# EAGLE design ICSP-Breadboard-Adapter-ATMEGA328 (EAGLE 7.5.0)
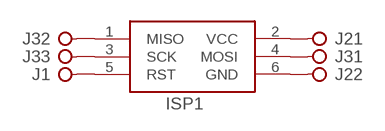
[diagram p0: schematic, sheet 1]

## Parts
ISP1  ICSP-HEADER-6  [ICSP-HEADER]
J1  PINHD-1X1  [1X01]
J2  PINHD-1X2  [1X02]
J3  PINHD-1X3  [1X03]

## Nets
GND: ISP1.6(GND) J2.2
N$1: ISP1.5(RST) J1.1(KL)
N$2: ISP1.2(VCC) J2.1
N$4: ISP1.4(MOSI) J3.1
N$5: ISP1.1(MISO) J3.2
N$6: ISP1.3(SCK) J3.3

## Library data of the parts
ISP1 = SaintGimp:ICSP-HEADER: ICSP HEADER Standard 6 pin header for ICSP programming
J1 = SaintGimp:PINHD-1X1
J2 = SaintGimp:PINHD-1X2
J3 = SaintGimp:PINHD-1X3: PIN HEADER

## Board
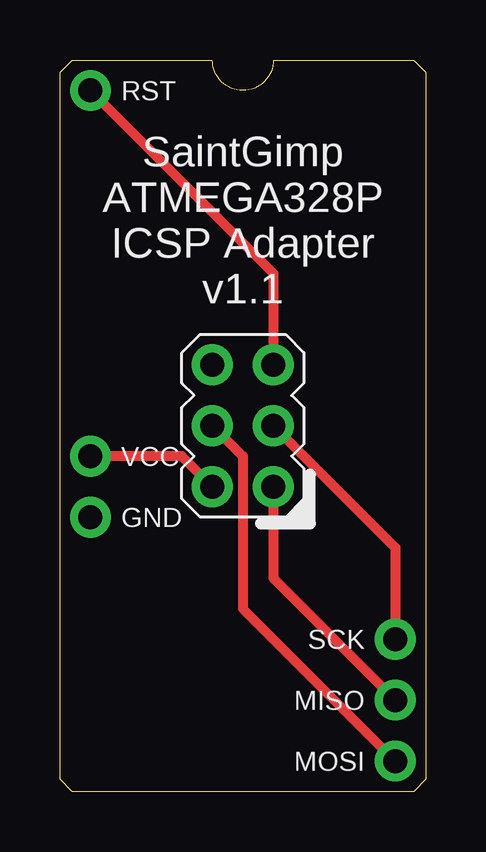
[diagram p1: board, top side]
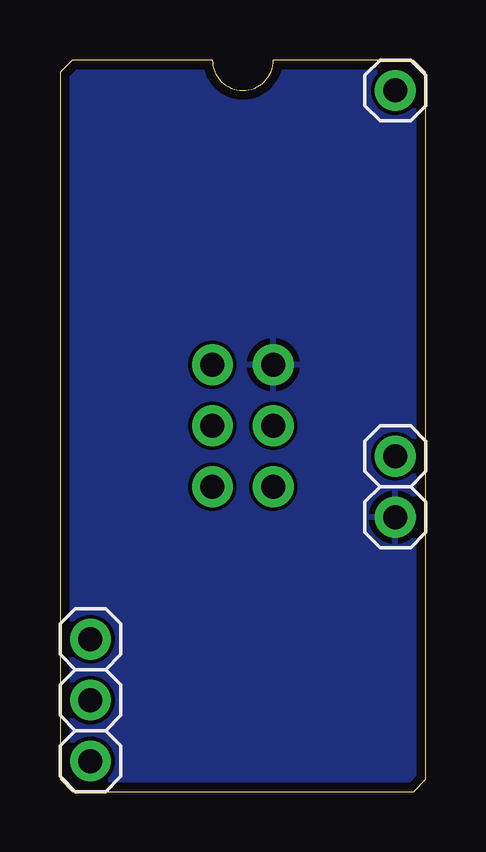
[diagram p2: board, bottom side, seen from below]

Size 15.24 x 30.48 mm. Coordinates in mm from the lower left corner, seen from the top.
Outline: 8.89,30.48 14.73,30.48 15.24,29.97 15.24,0.51 14.73,0 0.51,0 0,0.51 0,29.97 0.51,30.48 6.35,30.48 arc180 8.89,30.48
Copper layers (1*16): Top 0.0356mm / dielectric 1.5011mm / Bottom 0.0356mm
Design rules "Saintgimp-OSHPark *": minimum track width 10mil, minimum drill 13mil, track to track 6mil, track to pad 6mil, pad to pad 6mil, via to via 6mil, smd to smd 6mil, copper to edge 15mil, drill to drill 6mil, minimum pad ring 10mil, minimum via ring 7mil, stop-mask expansion 2mil, vias tented up to drill 24mil, thermal gap 10mil

### Footprints (pad centres in the part's own frame; a part is rotated, then mirrored left to right if it is on the bottom)
ICSP-HEADER = drill 1: 1 -1.27,2.54; 2 1.27,2.54; 3 -1.27,0; 4 1.27,0; 5 -1.27,-2.54; 6 1.27,-2.54
1X01 = drill 1: 1 0,0
1X02 = drill 1: 1 -1.27,0; 2 1.27,0
1X03 = drill 1: 1 -2.54,0; 2 0,0; 3 2.54,0

### Placement (x,y rotation side)
ISP1  7.62,15.24 180 top
J1  1.27,29.21 0 bottom
J2  1.27,12.7 270 bottom
J3  13.97,3.81 90 bottom

### Tracks (layer width: path | path; a pad name or v marks a point on that pad's centre or on a via)
GND
  pour Bottom: 0,30.48 15.24,30.48 15.24,0 0,0
N$1
  Top 0.406: J1.1 8.89,21.59 ISP1.5
N$2
  Top 0.406: ISP1.2 5.08,13.97 J2.1
N$4
  Top 0.406: ISP1.4 7.62,13.97 7.62,7.62 J3.1
N$5
  Top 0.406: ISP1.1 8.89,8.89 J3.2
N$6
  Top 0.406: ISP1.3 13.97,10.16 J3.3

### Text on the board
_tsilk: RST | SaintGimp | ATMEGA328P | ICSP Adapter | v1.1 | VCC | GND | SCK | MISO | MOSI